# Altium project 28Pins_Project_V1I1.PrjPCB
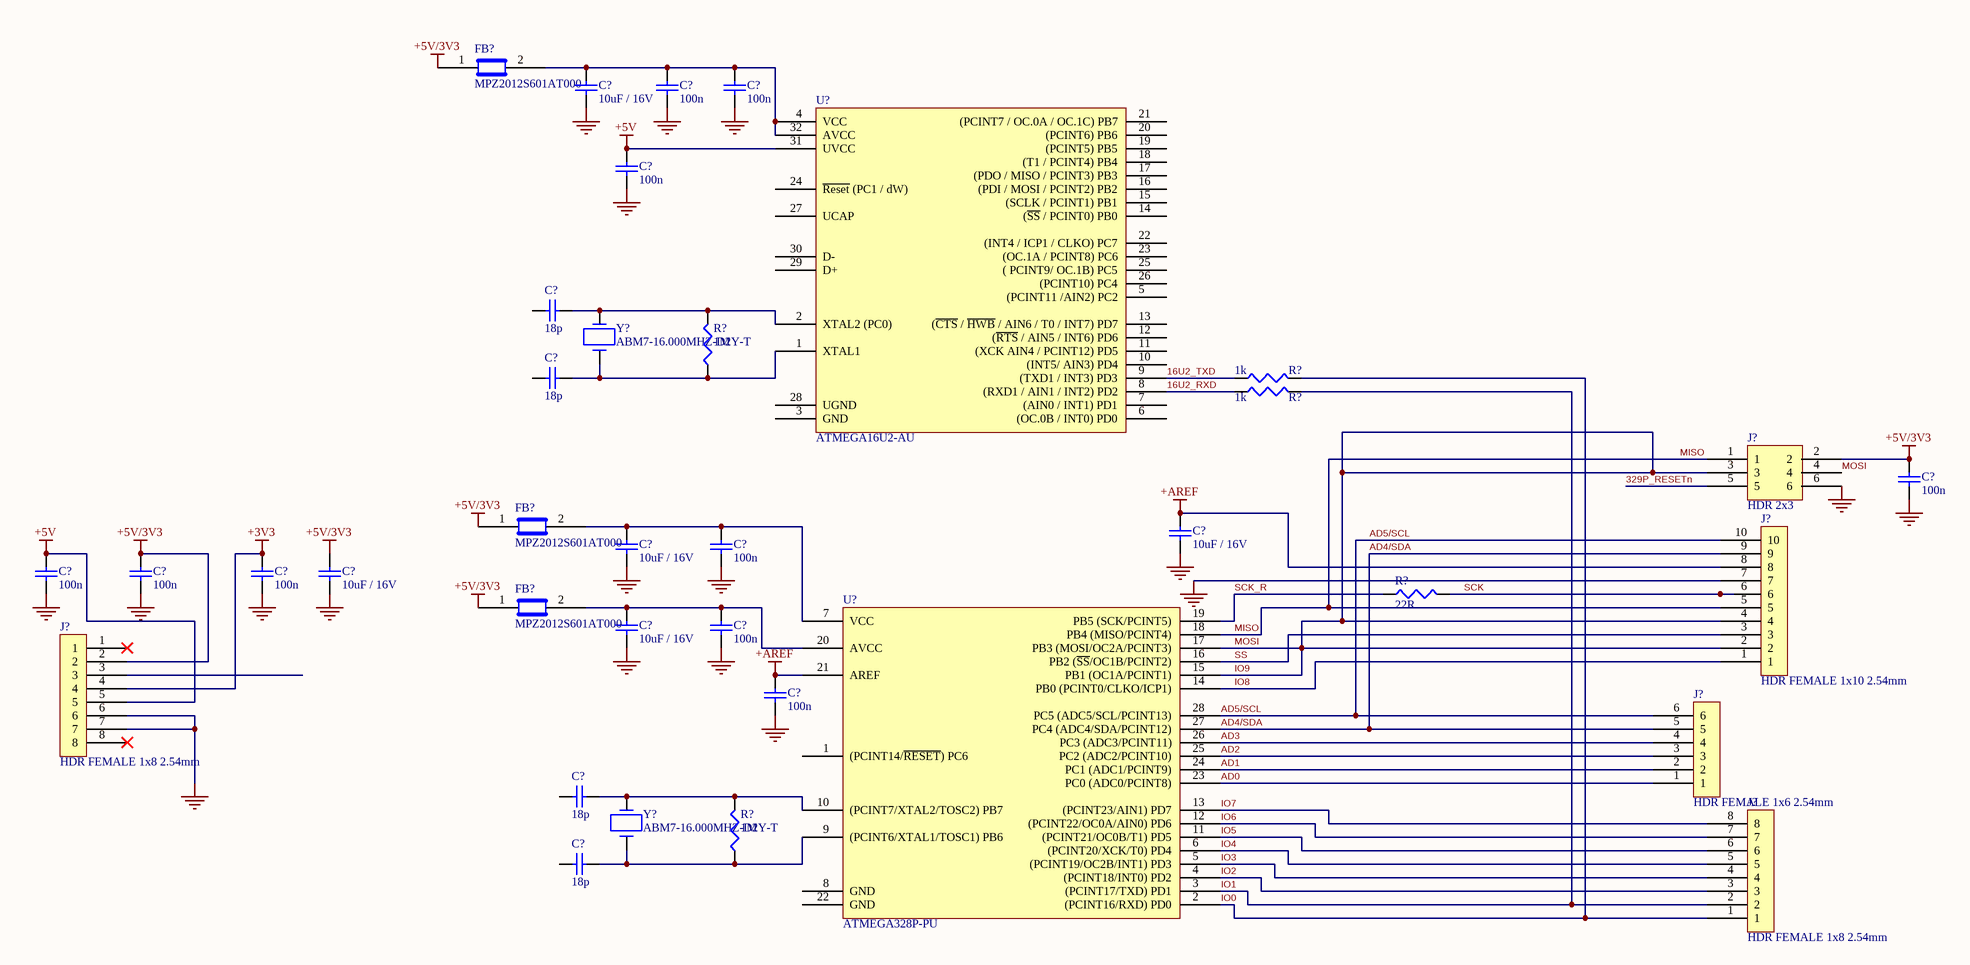
[diagram p0: 28Pins_Schematic.SchDoc]
1 sheet, 36 parts. Net scope: global (net labels, ports and power ports of the same name join across sheets).
Board file: 28Pins_Project_V1I1_PCB.PcbDoc

## Sheet 28Pins_Schematic.SchDoc
size A2

### Parts
(Parts that share a designator on the sheet are numbered #1, #2 ... from top to bottom, then left to right.)
C?#1  10uF / 16V  [C0805]
C?#2  100n  [C0805]
C?#3  100n  [C0805]
C?#4  100n  [C0805]
C?#5  18p  [C0805]
C?#6  18p  [C0805]
C?#7  100n  [C0805]
C?#8  10uF / 16V  [C0805]
C?#9  10uF / 16V  [C0805]
C?#10  100n  [C0805]
C?#11  100n  [C0805]
C?#12  100n  [C0805]
C?#13  100n  [C0805]
C?#14  10uF / 16V  [C0805]
C?#15  10uF / 16V  [C0805]
C?#16  100n  [C0805]
C?#17  100n  [C0805]
C?#18  18p  [C0805]
C?#19  18p  [C0805]
FB?#1  MPZ2012S601AT000  [C0805]
FB?#2  MPZ2012S601AT000  [C0805]
FB?#3  MPZ2012S601AT000  [C0805]
J?#1  HDR 2x3  [HDR_2x3_2.54MM]
J?#2  HDR FEMALE 1x10 2.54mm  [Hdr_Female_1x10_2.54mm]
J?#3  HDR FEMALE 1x8 2.54mm  [Hdr_Female_1x8_2.54mm]
J?#4  HDR FEMALE 1x6 2.54mm  [Hdr_Female_1x6_2.54mm]
J?#5  HDR FEMALE 1x8 2.54mm  [Hdr_Female_1x8_2.54mm]
R?#1  1M  [R0805]
R?#2  1k  [R0805]
R?#3  1k  [R0805]
R?#4  22R  [R0805]
R?#5  1M  [R0805]
U?#1  ATMEGA16U2-AU  [TQFP32]
U?#2  ATMEGA328P-PU  [28_DIP_7.62mm]
Y?#1  ABM7-16.000MHZ-D2Y-T  [ABMY_v1_1_BIG]
Y?#2  ABM7-16.000MHZ-D2Y-T  [ABMY_v1_1_BIG]

### Nets
+3V3: C?#13.2 J?#3.4
+5V: C?#4.2 C?#11.2 J?#3.5 U?#1.31(UVCC)
+5V/3V3: C?#7.2 C?#12.2 C?#14.2 FB?#1.1 FB?#2.1 FB?#3.1 J?#1.2 J?#3.2
+AREF: C?#8.1 C?#17.2 J?#2.8 U?#2.21(AREF)
GND: C?#1.1 C?#2.1 C?#3.1 C?#4.1 C?#7.1 C?#8.2 C?#9.1 C?#10.1 C?#11.1 C?#12.1 C?#13.1 C?#14.1 C?#15.1 C?#16.1 C?#17.1 J?#1.6 J?#2.7 J?#3.6 J?#3.7
16U2_RXD: R?#3.1 U?#1.8((RXD1_/_AIN1_/_INT2)_PD2)
16U2_TXD: R?#2.1 U?#1.9((TXD1_/_INT3)_PD3)
329P_RESETn: J?#1.5
AD0: J?#4.1 U?#2.23(PC0_(ADC0/PCINT8))
AD1: J?#4.2 U?#2.24(PC1_(ADC1/PCINT9))
AD2: J?#4.3 U?#2.25(PC2_(ADC2/PCINT10))
AD3: J?#4.4 U?#2.26(PC3_(ADC3/PCINT11))
AD4/SDA: J?#2.9 J?#4.5 U?#2.27(PC4_(ADC4/SDA/PCINT12))
AD5/SCL: J?#2.10 J?#4.6 U?#2.28(PC5_(ADC5/SCL/PCINT13))
IO0: J?#5.1 R?#2.2 U?#2.2((PCINT16/RXD)_PD0)
IO1: J?#5.2 R?#3.2 U?#2.3((PCINT17/TXD)_PD1)
IO2: J?#5.3 U?#2.4((PCINT18/INT0)_PD2)
IO3: J?#5.4 U?#2.5((PCINT19/OC2B/INT1)_PD3)
IO4: J?#5.5 U?#2.6((PCINT20/XCK/T0)_PD4)
IO5: J?#5.6 U?#2.11((PCINT21/OC0B/T1)_PD5)
IO6: J?#5.7 U?#2.12((PCINT22/OC0A/AIN0)_PD6)
IO7: J?#5.8 U?#2.13((PCINT23/AIN1)_PD7)
IO8: J?#2.1 U?#2.14(PB0_(PCINT0/CLKO/ICP1))
IO9: J?#1.3 J?#1.4 J?#2.2 J?#2.4 U?#2.15(PB1_(OC1A/PCINT1)) U?#2.17(PB3_(MOSI/OC2A/PCINT3))  [also labelled MOSI]
MISO: J?#1.1 J?#2.5 U?#2.18(PB4_(MISO/PCINT4))
SCK: J?#2.6 R?#4.2
SCK_R: R?#4.1 U?#2.19(PB5_(SCK/PCINT5))
SS: J?#2.3 U?#2.16(PB2_(~{SS}/OC1B/PCINT2))
NetC?#1_2: C?#1.2 C?#2.2 C?#3.2 FB?#1.2 U?#1.4(VCC) U?#1.32(AVCC)
NetC?#5_2: C?#5.2 R?#1.2 U?#1.2(XTAL2_(PC0)) Y?#1.2
NetC?#6_2: C?#6.2 R?#1.1 U?#1.1(XTAL1) Y?#1.1
NetC?#9_2: C?#9.2 C?#10.2 FB?#2.2 U?#2.7(VCC)
NetC?#15_2: C?#15.2 C?#16.2 FB?#3.2 U?#2.20(AVCC)
NetC?#18_2: C?#18.2 R?#5.2 U?#2.10((PCINT7/XTAL2/TOSC2)_PB7) Y?#2.2
NetC?#19_2: C?#19.2 R?#5.1 U?#2.9((PCINT6/XTAL1/TOSC1)_PB6) Y?#2.1

Not connected (* = marked no-connect by the designer): C?#5 1; C?#6 1; C?#18 1; C?#19 1; J?#3 1* 3 8*; U?#1 3(GND) 5((PCINT11_/AIN2)_PC2) 6((OC.0B_/_INT0)_PD0) 7((AIN0_/_INT1)_PD1) 10((INT5/_AIN3)_PD4) 11((XCK_AIN4_/_PCINT12)_PD5) 12((~{RTS}_/_AIN5_/_INT6)_PD6) 13((~{CTS}_/_~{HWB}_/_AIN6_/_T0_/_INT7)_PD7) 14((~{SS}_/_PCINT0)_PB0) 15((SCLK_/_PCINT1)_PB1) 16((PDI_/_MOSI_/_PCINT2)_PB2) 17((PDO_/_MISO_/_PCINT3)_PB3) 18((T1_/_PCINT4)_PB4) 19((PCINT5)_PB5) 20((PCINT6)_PB6) 21((PCINT7_/_OC.0A_/_OC.1C)_PB7) 22((INT4_/_ICP1_/_CLKO)_PC7) 23((OC.1A_/_PCINT8)_PC6) 24(~{Reset}_(PC1_/_dW)) 25((_PCINT9/_OC.1B)_PC5) 26((PCINT10)_PC4) 27(UCAP) 28(UGND) 29(D+) 30(D-); U?#2 1((PCINT14/~{RESET})_PC6) 8(GND) 22(GND)

### Library data of the parts
C?#1 C?#8 C?#9 C?#14 C?#15 = C2012X5R1E106K125AB: CAP CER 10UF 25V X5R 0805; Manufacturer: TDK; Dielectric Material: Ceramic; Tolerance: 10%; Supplier 1: Digi-Key; Manufacturer Part Number: C2012X5R1E106K125AB; Stock 1: 227256; Pricing 1: 1=0.35, 10=0.238, 100=0.135, 500=0.0953, 1000=0.0834 (USD); Mount: Surface Mount; Case/Package: 0805; Weight: 0.000194oz; Case Code (Metric): 2012; Case Code (Imperial): 0805; Min Operating Temperature: -55°C; Max Operating Temperature: 85°C; Capacitance: 10uF; Packaging: Tape and Reel; Voltage Rating: 25V; Voltage Rating (DC): 25V; Dielectric: X5R; Termination: SMD/SMT; Voltage: 25V; Package Quantity: 1; Composition: Ceramic; Length: 2mm; Height: 1.25mm; Width: 0.049inch; Depth: 1.25mm; Thickness: 0.057inch; Lead Free: Lead Free; REACH SVHC: No SVHC; ComponentLink1URL: https://datasheet.ciiva.com/22725/1913358-22725561.pdf; ComponentLink1Description: https://datasheet.ciiva.com/22725/1913358-22725561.pdf; ComponentLink2URL: https://datasheet.ciiva.com/16394/general-b11-16394044.pdf; ComponentLink2Description: https://datasheet.ciiva.com/16394/general-b11-16394044.pdf; ComponentLink3URL: https://datasheet.ciiva.com/24216/mlcc-commercial-general-en-24216237.pdf; ComponentLink3Description: https://datasheet.ciiva.com/24216/mlcc-commercial-general-en-24216237.pdf; Supplier Part Number 1: 445-5984-1-ND
C?#2-C?#4 C?#7 C?#10-C?#13 C?#16 C?#17 = C2012X7R1H104K125AM: CAP CER 0.1UF 50V X7R 0805; Manufacturer: TDK; Tolerance: 10%; Capacitance: 100nF; Supplier 1: Digi-Key; Manufacturer Part Number: C2012X7R1H104K125AM; Stock 1: 306256; Pricing 1: 1=0.2, 10=0.14, 100=0.066, 500=0.0463, 1000=0.0383 (USD); Mount: Surface Mount; Case/Package: 0805; Number of Pins: 2; Weight: 0.000194oz; Case Code (Metric): 2012; Case Code (Imperial): 0805; Min Operating Temperature: -55°C; Max Operating Temperature: 125°C; Voltage Rating (DC): 50V; Packaging: Tape and Reel; Voltage Rating: 50V; Termination: SMD/SMT; Package Quantity: 1; Dielectric: X7R; Composition: Ceramic; Length: 2mm; Height: 1.25mm; Width: 0.049inch; Thickness: 0.057inch; Depth: 1.25mm; REACH SVHC: No SVHC; Lead Free: Lead Free; ComponentLink1URL: https://datasheet.ciiva.com/24219/c2012x7r1h104k125am-264899-24219449.pdf; ComponentLink1Description: https://datasheet.ciiva.com/24219/c2012x7r1h104k125am-264899-24219449.pdf; Supplier Part Number 1: 445-6045-6-ND
C?#5 C?#6 C?#18 C?#19 = C0805C180J5GAC-TU: CAP CER 18PF 50V NP0 0805; Manufacturer: KEMET; Dielectric Material: Ceramic; Tolerance: 5%; Dielectric: C0G; Temperature Coefficient: 30ppm/°C; Dissipation Factor: 0.1%; Supplier 1: Digi-Key; Manufacturer Part Number: C0805C180J5GAC-TU; Stock 1: 86282; Pricing 1: 1=0.11, 10=0.08, 100=0.0374, 500=0.0262, 1000=0.0217 (USD); Mount: Surface Mount,PCB; Case/Package: 0805; Number of Pins: 2; Case Code (Metric): 2012; Case Code (Imperial): 0805; Contact Material: Tin; Min Operating Temperature: -55°C; Max Operating Temperature: 125°C; Voltage Rating (DC): 50V; Packaging: Tape and Reel; Capacitance: 18pF; Termination: SMD/SMT; Voltage: 50V; Voltage Rating: 50V; Package Quantity: 1; Length: 2mm; Height: 0.78mm; Depth: 1.25mm; Width: 0.049inch; Thickness: 0.035inch; Lead Pitch: 0.75mm; Radiation Hardening: No; Lead Free: Lead Free; REACH SVHC: No SVHC; ComponentLink1URL: https://datasheet.ciiva.com/6136/1725432-6136736.pdf; ComponentLink1Description: https://datasheet.ciiva.com/6136/1725432-6136736.pdf; ComponentLink2URL: https://datasheet.ciiva.com/144/docfinderpartnumber-c0805c180j5gactu-144929.pdf; ComponentLink2Description: https://datasheet.ciiva.com/144/docfinderpartnumber-c0805c180j5gactu-144929.pdf; ComponentLink3URL: https://datasheet.ciiva.com/22746/1769375-22746770.pdf; ComponentLink3Description: https://datasheet.ciiva.com/22746/1769375-22746770.pdf; ComponentLink4URL: https://datasheet.ciiva.com/28696/1789732-28696024.pdf; ComponentLink4Description: https://datasheet.ciiva.com/28696/1789732-28696024.pdf; ComponentLink5URL: https://datasheet.ciiva.com/7842/1725432-7842235.pdf; ComponentLink5Description: https://datasheet.ciiva.com/7842/1725432-7842235.pdf; ComponentLink6URL: https://datasheet.ciiva.com/11463/kem-c1003-c0g-smd-11463499.pdf; ComponentLink6Description: https://datasheet.ciiva.com/11463/kem-c1003-c0g-smd-11463499.pdf; ComponentLink7URL: https://datasheet.ciiva.com/7842/1725432-7842236.pdf; ComponentLink7Description: https://datasheet.ciiva.com/7842/1725432-7842236.pdf; ComponentLink8URL: https://datasheet.ciiva.com/26923/getdatasheetpartid-759702-26923980.pdf; ComponentLink8Description: https://datasheet.ciiva.com/26923/getdatasheetpartid-759702-26923980.pdf; ComponentLink9URL: https://datasheet.ciiva.com/5419/kem-c1003-c0g-smd-356956-5419246.pdf; ComponentLink9Description: https://datasheet.ciiva.com/5419/kem-c1003-c0g-smd-356956-5419246.pdf; Supplier Part Number 1: 399-1112-6-ND
FB?#1-FB?#3 = MPZ2012S601AT000: TDK   MPZ2012S601AT000   FERRITE BEAD, 0.1OHM, 2A, 0805, FULL REEL; Impedance: 600R; DC Resistance (DCR): 100mR; Supplier 1: Digi-Key; Manufacturer: TDK; Manufacturer Part Number: MPZ2012S601AT000; Stock 1: 229603; Pricing 1: 1=0.11, 10=0.091, 25=0.0704, 50=0.0584, 100=0.0503, 250=0.0403, 500=0.0362, 1000=0.0302 (USD); Mount: Surface Mount; Case/Package: 0805; Case Code (Metric): 2012; Case Code (Imperial): 0805; Packaging: Tape and Reel; Package Quantity: 1; Current Rating: 2A; Max DC Current: 2A; Length: 0.079inch; Height: 0.041inch; Width: 0.049inch; REACH SVHC: No SVHC; Lead Free: Lead Free; ComponentLink1URL: https://datasheet.ciiva.com/46634/beads-commercial-power-mpz-en-46634377.pdf; ComponentLink1Description: https://datasheet.ciiva.com/46634/beads-commercial-power-mpz-en-46634377.pdf; ComponentLink2URL: https://datasheet.ciiva.com/46381/1750041-46381645.pdf; ComponentLink2Description: https://datasheet.ciiva.com/46381/1750041-46381645.pdf; ComponentLink3URL: https://datasheet.ciiva.com/46634/beads-commercial-power-mpz-en-46634606.pdf; ComponentLink3Description: https://datasheet.ciiva.com/46634/beads-commercial-power-mpz-en-46634606.pdf; ComponentLink4URL: https://datasheet.ciiva.com/46634/beads-commercial-power-mpz-en-46634335.pdf; ComponentLink4Description: https://datasheet.ciiva.com/46634/beads-commercial-power-mpz-en-46634335.pdf; Supplier Part Number 1: 445-2206-6-ND
J?#1 = 67997-106HLF: 6 Positions Header, Unshrouded Connector 0.100" (2.54mm) Through Hole Gold or Gold, GXT™; Manufacturer: Amphenol FCI; Number of Contacts: 6; Current Rating: 3A; Voltage Rating: 1.5kV; Insulation Resistance: 5GR; Gender: Male; Connector Type: Male Pin; Row Spacing: 0.1inch; Mating Post Length: 5.84mm; Supplier 1: Digi-Key; Manufacturer Part Number: 67997-106HLF; Stock 1: 896; Pricing 1: 1=1.73, 10=1.568, 100=1.3436, 500=1.1197, 1000=0.9597, 5000=0.8509, 10000=0.8317 (USD); Mount: Through Hole; Contact Plating: Nickel,Gold,GXT; Contact Material: Bronze; Colour: Black; Housing Colour: Black; Housing Material: Thermoplastic; Min Operating Temperature: -65°C; Max Operating Temperature: 125°C; Number of Rows: 2; Termination: Through Hole; Packaging: Bulk; Package Quantity: 100; Contact Gender: Male; Number of Positions: 6; Max Voltage Rating (AC): 1.5kV; Orientation: Straight; Length: 7.62mm; Pitch: 2.54mm; Contact Mating Length: 0.23inch; Termination Post Length: 3.05mm; Depth: 4.83mm; Radiation Hardening: No; REACH SVHC: No SVHC; Lead Free: Lead Free; Flammability Rating: UL94 V-0; ComponentLink1URL: https://datasheet.ciiva.com/10149/67996-10149221.pdf; ComponentLink1Description: https://datasheet.ciiva.com/10149/67996-10149221.pdf; ComponentLink2URL: https://datasheet.ciiva.com/46393/1876884-46393067.pdf; ComponentLink2Description: https://datasheet.ciiva.com/46393/1876884-46393067.pdf; ComponentLink3URL: https://datasheet.ciiva.com/722/67996-722044.pdf; ComponentLink3Description: https://datasheet.ciiva.com/722/67996-722044.pdf; ComponentLink4URL: https://datasheet.ciiva.com/5153/67996-222463-5153820.pdf; ComponentLink4Description: https://datasheet.ciiva.com/5153/67996-222463-5153820.pdf; ComponentLink5URL: https://datasheet.ciiva.com/16726/67996-16726286.pdf; ComponentLink5Description: https://datasheet.ciiva.com/16726/67996-16726286.pdf; Supplier Part Number 1: 609-3393-ND
J?#2 = M20-7821046: Headers & Wire Housings 10 PIN SIL VERTICAL SOCKET TIN; Manufacturer: Harwin; Number of Contacts: 10; Max Current Rating: 3A; Contact Resistance: 20mR; Mating Cycles: 50; Connector Type: Receptacle,Socket; Gender: Receptacle; Insulation Resistance: 1MR; Hole Diameter: 0.8mm; Supplier 1: Digi-Key; Manufacturer Part Number: M20-7821046; Stock 1: 747; Pricing 1: 1=1.28, 10=1.122, 100=0.968, 500=0.792, 1000=0.704, 5000=0.616, 10000=0.5852 (USD); Mount: Through Hole; Case/Package: SIL; Colour: Black; Contact Plating: Tin; Contact Material: Bronze; Housing Colour: Black; Housing Material: Polyamide; Min Operating Temperature: -40°C; Max Operating Temperature: 105°C; Number of Rows: 1; Termination: Solder; Packaging: Rail/Tube; Contact Gender: Female; Package Quantity: 23; Current Rating: 3A; Number of Positions: 10; Orientation: Straight; Length: 25.8mm; Pitch: 2.54mm; Lead Pitch: 2.54mm; Depth: 2.5mm; Radiation Hardening: No; REACH SVHC: No SVHC; ComponentLink1URL: https://datasheet.ciiva.com/26899/getdatasheetpartid-559226-26899379.pdf; ComponentLink1Description: https://datasheet.ciiva.com/26899/getdatasheetpartid-559226-26899379.pdf; ComponentLink2URL: https://datasheet.ciiva.com/6785/m20-782-6785605.pdf; ComponentLink2Description: https://datasheet.ciiva.com/6785/m20-782-6785605.pdf; ComponentLink3URL: https://datasheet.ciiva.com/10151/m20-782-10151366.pdf; ComponentLink3Description: https://datasheet.ciiva.com/10151/m20-782-10151366.pdf; ComponentLink4URL: https://datasheet.ciiva.com/16732/m20-782-16732152.pdf; ComponentLink4Description: https://datasheet.ciiva.com/16732/m20-782-16732152.pdf; ComponentLink5URL: https://datasheet.ciiva.com/11753/0900766b80dc1d2b-11753869.pdf; ComponentLink5Description: https://datasheet.ciiva.com/11753/0900766b80dc1d2b-11753869.pdf; Supplier Part Number 1: 952-1847-ND
J?#3 J?#5 = M20-7820842: Headers & Wire Housings 8 PIN SIL VERTICAL SOCKET GOLD+TIN; Manufacturer: Harwin; Number of Contacts: 8; Max Current Rating: 3A; Contact Resistance: 20mR; Connector Type: Receptacle,Socket; Supplier 1: Digi-Key; Manufacturer Part Number: M20-7820842; Stock 1: 674; Pricing 1: 1=1.1, 10=0.972, 100=0.8382, 500=0.6858, 1000=0.6096, 5000=0.5334, 10000=0.5067 (USD); Mount: Through Hole; Case/Package: SIL; Weight: 0.025397oz; Contact Plating: Tin,Gold; Colour: Black; Contact Material: Bronze; Housing Colour: Black; Housing Material: Polyamide; Min Operating Temperature: -40°C; Max Operating Temperature: 105°C; Number of Rows: 1; Termination: Solder; Contact Gender: Female; Package Quantity: 29; Packaging: Rail/Tube; Number of Positions: 8; Orientation: Straight; Gender: Female; Length: 20.72mm; Pitch: 2.54mm; Depth: 2.5mm; Radiation Hardening: No; ComponentLink1URL: https://datasheet.ciiva.com/16732/m20-782-16732663.pdf; ComponentLink1Description: https://datasheet.ciiva.com/16732/m20-782-16732663.pdf; ComponentLink2URL: https://datasheet.ciiva.com/9480/m20-782-9480074.pdf; ComponentLink2Description: https://datasheet.ciiva.com/9480/m20-782-9480074.pdf; Supplier Part Number 1: 952-1823-ND
J?#4 = M20-7820646: Headers & Wire Housings 6 PIN SIL VERTICAL SOCKET TIN; Manufacturer: Harwin; Number of Contacts: 6; Max Current Rating: 3A; Contact Resistance: 20mR; Connector Type: Receptacle,Socket; Supplier 1: Digi-Key; Manufacturer Part Number: M20-7820646; Stock 1: 1902; Pricing 1: 1=0.96, 10=0.842, 100=0.726, 500=0.594, 1000=0.528, 5000=0.462, 10000=0.4389 (USD); Mount: Through Hole; Case/Package: SIL; Colour: Black; Contact Plating: Tin; Contact Material: Bronze; Housing Colour: Black; Housing Material: Nylon; Min Operating Temperature: -40°C; Max Operating Temperature: 105°C; Number of Rows: 1; Termination: Solder; Packaging: Rail/Tube; Contact Gender: Female; Package Quantity: 38; Number of Positions: 6; Orientation: Straight; Gender: Female; Length: 15.64mm; Pitch: 2.54mm; Depth: 2.5mm; Radiation Hardening: No; ComponentLink1URL: http://components.arrow.com/part/dataview/0323_00725884; ComponentLink1Description: http://components.arrow.com/part/dataview/0323_00725884; ComponentLink2URL: http://www.mouser.com/ds/2/181/M20-782-351467.pdf; ComponentLink2Description: http://www.mouser.com/ds/2/181/M20-782-351467.pdf; ComponentLink3URL: http://www.harwin.com/include/downloads/pdfs/2010PAGE120.PDF; ComponentLink3Description: http://www.harwin.com/include/downloads/pdfs/2010PAGE120.PDF; ComponentLink4URL: https://cdn.harwin.com/pdfs/Harwin_Product_Catalog_page_197.pdf; ComponentLink4Description: https://cdn.harwin.com/pdfs/Harwin_Product_Catalog_page_197.pdf; ComponentLink5URL: https://cdn.harwin.com/pdfs/60page140.pdf; ComponentLink5Description: https://cdn.harwin.com/pdfs/60page140.pdf; Supplier Part Number 1: 952-1809-ND
R?#1 R?#5 = RC0805FR-071ML: RES SMD 1M OHM 1% 1/8W 0805; Manufacturer: Yageo; Resistance: 1MR; Temperature Coefficient: 100ppm/°C; Power Rating: 125mW; Voltage Rating: 150V; Supplier 1: Digi-Key; Manufacturer Part Number: RC0805FR-071ML; Stock 1: 2559906; Pricing 1: 1=0.1, 10=0.022, 100=0.0088, 1000=0.004, 2500=0.0034 (USD); Case/Package: 0805; Case Code (Metric): 2012; Case Code (Imperial): 0805; Min Operating Temperature: -55°C; Max Operating Temperature: 155°C; Tolerance: 1%; Packaging: Tape and Reel; Composition: Thick Film; Package Quantity: 1; Number of Terminations: 2; Termination: SMD/SMT; Military Standard: Not; Max Power Dissipation: 125mW; Length: 0.079inch; Height: 0.024inch; Width: 0.049inch; Depth: 1.25mm; REACH SVHC: Unknown; Lead Free: Lead Free; ComponentLink1URL: https://datasheet.ciiva.com/2519/pyu-r-int-thick-7-2519712.pdf; ComponentLink1Description: https://datasheet.ciiva.com/2519/pyu-r-int-thick-7-2519712.pdf; ComponentLink2URL: https://datasheet.ciiva.com/2519/pyu-r-int-thick-7-2519713.pdf; ComponentLink2Description: https://datasheet.ciiva.com/2519/pyu-r-int-thick-7-2519713.pdf; ComponentLink3URL: https://datasheet.ciiva.com/11808/0900766b8106beab-11808209.pdf; ComponentLink3Description: https://datasheet.ciiva.com/11808/0900766b8106beab-11808209.pdf; ComponentLink4URL: https://datasheet.ciiva.com/17419/rc0805-17419909.pdf; ComponentLink4Description: https://datasheet.ciiva.com/17419/rc0805-17419909.pdf; ComponentLink5URL: https://datasheet.ciiva.com/2519/pyu-r-int-thick-7-2519711.pdf; ComponentLink5Description: https://datasheet.ciiva.com/2519/pyu-r-int-thick-7-2519711.pdf; ComponentLink6URL: https://datasheet.ciiva.com/12666/rc0805-12666975.pdf; ComponentLink6Description: https://datasheet.ciiva.com/12666/rc0805-12666975.pdf; Supplier Part Number 1: 311-1.00MCRDKR-ND
R?#2 R?#3 = RC0805FR-071KL: RES SMD 1K OHM 1% 1/8W 0805; Manufacturer: Yageo; Resistance: 1kR; Temperature Coefficient: 100ppm/°C; Voltage Rating (DC): 150V; Power Rating: 125mW; Supplier 1: Digi-Key; Manufacturer Part Number: RC0805FR-071KL; Stock 1: 8516824; Pricing 1: 1=0.1, 10=0.022, 100=0.0088, 1000=0.004, 2500=0.0034 (USD); Case/Package: 0805; Number of Pins: 2; Case Code (Metric): 2012; Case Code (Imperial): 0805; Min Operating Temperature: -55°C; Max Operating Temperature: 155°C; Tolerance: 1%; Packaging: Tape and Reel; Composition: Thick Film; Package Quantity: 1; Voltage Rating: 150V; Number of Terminations: 2; Termination: SMD/SMT; Military Standard: Not; Max Power Dissipation: 125mW; Length: 0.079inch; Height: 0.024inch; Width: 0.049inch; Depth: 1.25mm; REACH SVHC: Unknown; Lead Free: Lead Free; ComponentLink1URL: https://datasheet.ciiva.com/2456/pyu-r-int-thick-7-2456976.pdf; ComponentLink1Description: https://datasheet.ciiva.com/2456/pyu-r-int-thick-7-2456976.pdf; ComponentLink2URL: https://datasheet.ciiva.com/2456/pyu-r-int-thick-7-2456977.pdf; ComponentLink2Description: https://datasheet.ciiva.com/2456/pyu-r-int-thick-7-2456977.pdf; ComponentLink3URL: https://datasheet.ciiva.com/11819/0900766b8106beab-11819814.pdf; ComponentLink3Description: https://datasheet.ciiva.com/11819/0900766b8106beab-11819814.pdf; ComponentLink4URL: https://datasheet.ciiva.com/7941/1686128-7941719.pdf; ComponentLink4Description: https://datasheet.ciiva.com/7941/1686128-7941719.pdf; ComponentLink5URL: https://datasheet.ciiva.com/16850/rc0805-16850409.pdf; ComponentLink5Description: https://datasheet.ciiva.com/16850/rc0805-16850409.pdf; ComponentLink6URL: https://datasheet.ciiva.com/46385/444164-46385020.pdf; ComponentLink6Description: https://datasheet.ciiva.com/46385/444164-46385020.pdf; ComponentLink7URL: https://datasheet.ciiva.com/2456/pyu-r-int-thick-7-2456975.pdf; ComponentLink7Description: https://datasheet.ciiva.com/2456/pyu-r-int-thick-7-2456975.pdf; Supplier Part Number 1: 311-1.00KCRDKR-ND
R?#4 = RC0805FR-0722RL: RES SMD 22 OHM 1% 1/8W 0805; Manufacturer: Yageo; Temperature Coefficient: 100ppm/°C; Power Rating: 125mW; Voltage Rating: 150V; Supplier 1: Digi-Key; Manufacturer Part Number: RC0805FR-0722RL; Stock 1: 1627209; Pricing 1: 1=0.1, 10=0.022, 100=0.0088, 1000=0.004, 2500=0.0034 (USD); Case/Package: 0805; Case Code (Metric): 2012; Case Code (Imperial): 0805; Min Operating Temperature: -55°C; Max Operating Temperature: 155°C; Resistance: 22R; Tolerance: 1%; Composition: Thick Film; Packaging: Tape and Reel; Package Quantity: 1; Number of Terminations: 2; Termination: SMD/SMT; Military Standard: Not; Max Power Dissipation: 125mW; Length: 0.079inch; Height: 0.024inch; Width: 0.049inch; Depth: 1.25mm; REACH SVHC: Unknown; Lead Free: Lead Free; ComponentLink1URL: https://datasheet.ciiva.com/2457/pyu-r-int-thick-7-2457044.pdf; ComponentLink1Description: https://datasheet.ciiva.com/2457/pyu-r-int-thick-7-2457044.pdf; ComponentLink2URL: https://datasheet.ciiva.com/2457/pyu-r-int-thick-7-2457045.pdf; ComponentLink2Description: https://datasheet.ciiva.com/2457/pyu-r-int-thick-7-2457045.pdf; ComponentLink3URL: https://datasheet.ciiva.com/2457/pyu-r-int-thick-7-2457046.pdf; ComponentLink3Description: https://datasheet.ciiva.com/2457/pyu-r-int-thick-7-2457046.pdf; ComponentLink4URL: https://datasheet.ciiva.com/46447/444164-46447574.pdf; ComponentLink4Description: https://datasheet.ciiva.com/46447/444164-46447574.pdf; ComponentLink5URL: https://datasheet.ciiva.com/16741/rc0805-16741465.pdf; ComponentLink5Description: https://datasheet.ciiva.com/16741/rc0805-16741465.pdf; ComponentLink6URL: https://datasheet.ciiva.com/12667/rc0805-12667371.pdf; ComponentLink6Description: https://datasheet.ciiva.com/12667/rc0805-12667371.pdf; ComponentLink7URL: https://datasheet.ciiva.com/11819/0900766b8106beab-11819837.pdf; ComponentLink7Description: https://datasheet.ciiva.com/11819/0900766b8106beab-11819837.pdf; Supplier Part Number 1: 311-22.0CRDKR-ND
U?#1 = ATMEGA16U2-AU: ATMEL         ATMEGA16U2-AU            MCU, 8BIT, MEGAAVR, 16MHZ, TQFP-32; Manufacturer: Microchip / Atmel; Core Architecture: AVR; Data Bus Width: 8b; RAM Size: 512B; Interface: SPI,Serial,USB,UART,USART; Number of Timers/Counters: 2; Max Supply Voltage: 5.5V; Min Supply Voltage: 2.7V; Number of Programmable I/O: 22; Watchdog Timer: Yes; Memory Type: FLASH; Memory Size: 16KB; Number of PWM Channels: 5; Oscillator Type: Internal; Number of SPI Channels: 1; Peripherals: Brown-out Detect/Reset,POR,PWM,WDT; Supplier 1: Digi-Key; Manufacturer Part Number: ATMEGA16U2-AU; Stock 1: 5058; Pricing 1: 1=2.6, 25=2.3852, 100=2.1624 (USD); Mount: Surface Mount; Case/Package: A; Number of Pins: 32; Contact Plating: Tin,Matte; Min Operating Temperature: -40°C; Max Operating Temperature: 85°C; Package Quantity: 1250; Frequency: 16MHz; Packaging: Tray; Max Frequency: 16MHz; Number of I/Os: 22; Length: 7mm; Height: 1.05mm; Width: 7mm; REACH SVHC: No SVHC; Lead Free: Lead Free; ComponentLink1URL: https://datasheet.ciiva.com/13036/doc7799-28769-13036800.pdf; ComponentLink1Description: https://datasheet.ciiva.com/13036/doc7799-28769-13036800.pdf; ComponentLink2URL: https://datasheet.ciiva.com/22651/doc7799-22651110.pdf; ComponentLink2Description: https://datasheet.ciiva.com/22651/doc7799-22651110.pdf; Supplier Part Number 1: ATMEGA16U2-AU-ND
U?#2 = ATMEGA328P-PU: ATMEL         ATMEGA328P-PU            8 Bit Microcontroller, Low Power High Performance, ATmega, 20 MHz, 32 KB, 2 KB, 28 Pins, DIP; Manufacturer: Microchip / Atmel; Core Architecture: AVR; RAM Size: 2KB; Number of PWM Channels: 6; Number of Timers/Counters: 3; Min Supply Voltage: 1.8V; Max Supply Voltage: 5.5V; Interface: I2C,SPI,UART,USART,2-Wire; Number of I/Os: 23; Frequency: 20MHz; Oscillator Type: Internal; Data Bus Width: 8b; Number of SPI Channels: 1; Watchdog Timer: Yes; Memory Type: FLASH; Memory Size: 32KB; Peripherals: Brown-out Detect/Reset,POR,PWM,WDT; Supplier 1: Digi-Key; Manufacturer Part Number: ATMEGA328P-PU; Stock 1: 7808; Pricing 1: 1=2.2, 25=2.0248, 100=1.8338 (USD); Mount: Through Hole; Case/Package: PDIP; Number of Pins: 28; Contact Plating: Tin,Matte; Min Operating Temperature: -40°C; Max Operating Temperature: 85°C; Package Quantity: 14; Number of ADC Channels: 6; Packaging: Rail/Tube; Number of Programmable I/O: 23; Max Frequency: 20MHz; Number of I2C Channels: 1; Length: 37.4mm; Height: 3.28mm; Width: 6.76mm; Radiation Hardening: No; REACH SVHC: No SVHC; Lead Free: Lead Free; ComponentLink1URL: https://datasheet.ciiva.com/1157/1684409-1157696.pdf; ComponentLink1Description: https://datasheet.ciiva.com/1157/1684409-1157696.pdf; ComponentLink2URL: https://datasheet.ciiva.com/20168/73-4283-20168380.pdf; ComponentLink2Description: https://datasheet.ciiva.com/20168/73-4283-20168380.pdf; ComponentLink3URL: https://datasheet.ciiva.com/15213/getdatasheetpartid-318533-15213133.pdf; ComponentLink3Description: https://datasheet.ciiva.com/15213/getdatasheetpartid-318533-15213133.pdf; ComponentLink4URL: https://datasheet.ciiva.com/19457/2139111-19457070.pdf; ComponentLink4Description: https://datasheet.ciiva.com/19457/2139111-19457070.pdf; ComponentLink5URL: https://datasheet.ciiva.com/26818/atmega328p-pu-26818578.pdf; ComponentLink5Description: https://datasheet.ciiva.com/26818/atmega328p-pu-26818578.pdf; ComponentLink6URL: https://datasheet.ciiva.com/29119/155197-da-01-en-microcontr-atmega328p-pu-8bit-pdip-28-29119593.pdf; ComponentLink6Description: https://datasheet.ciiva.com/29119/155197-da-01-en-microcontr-atmega328p-pu-8bit-pdip-28-29119593.pdf
Y?#1 Y?#2 = ABM7-16.000MHZ-D2Y-T: Crystals 16.0MHz 20ppm 18pF -40C+85C; Manufacturer: Abracon; ESR (Equivalent Series Resistance): 50R; Frequency: 16MHz; Frequency Stability: 30ppm; Supplier 1: Digi-Key; Manufacturer Part Number: ABM7-16.000MHZ-D2Y-T; Stock 1: 1266; Pricing 1: 1=0.72, 10=0.633, 50=0.5912, 100=0.5225, 500=0.495 (USD); Mount: Surface Mount; Case/Package: CSMD; Number of Pins: 2; Min Operating Temperature: -40°C; Max Operating Temperature: 85°C; Frequency Tolerance: 20ppm; Load Capacitance: 18pF; Package Quantity: 1000; Tolerance: 20ppm; Packaging: Tape and Reel; Termination: SMD/SMT; Composition: Ceramic; Length: 6mm; Height: 0.055inch; Width: 3.3mm; Depth: 3.5mm; Radiation Hardening: No; REACH SVHC: Unknown; Lead Free: Lead Free; ComponentLink1URL: https://datasheet.ciiva.com/15116/getdatasheetpartid-721624-15116835.pdf; ComponentLink1Description: https://datasheet.ciiva.com/15116/getdatasheetpartid-721624-15116835.pdf; ComponentLink2URL: https://datasheet.ciiva.com/22658/947971-22658293.pdf; ComponentLink2Description: https://datasheet.ciiva.com/22658/947971-22658293.pdf; ComponentLink3URL: https://datasheet.ciiva.com/5788/abm7-5788054.pdf; ComponentLink3Description: https://datasheet.ciiva.com/5788/abm7-5788054.pdf; ComponentLink4URL: https://datasheet.ciiva.com/16383/abm7-16383174.pdf; ComponentLink4Description: https://datasheet.ciiva.com/16383/abm7-16383174.pdf; ComponentLink5URL: https://datasheet.ciiva.com/7998/947971-7998600.pdf; ComponentLink5Description: https://datasheet.ciiva.com/7998/947971-7998600.pdf; ComponentLink6URL: https://datasheet.ciiva.com/18649/abm7-18649865.pdf; ComponentLink6Description: https://datasheet.ciiva.com/18649/abm7-18649865.pdf; ComponentLink7URL: https://datasheet.ciiva.com/18649/abm7-18649866.pdf; ComponentLink7Description: https://datasheet.ciiva.com/18649/abm7-18649866.pdf; ComponentLink8URL: https://datasheet.ciiva.com/18649/abm7-18649867.pdf; ComponentLink8Description: https://datasheet.ciiva.com/18649/abm7-18649867.pdf; ComponentLink9URL: https://datasheet.ciiva.com/46385/947971-46385243.pdf; ComponentLink9Description: https://datasheet.ciiva.com/46385/947971-46385243.pdf; ComponentLink10URL: https://datasheet.ciiva.com/26941/getdatasheetpartid-719818-26941724.pdf; ComponentLink10Description: https://datasheet.ciiva.com/26941/getdatasheetpartid-719818-26941724.pdf; Supplier Part Number 1: 535-9840-1-ND